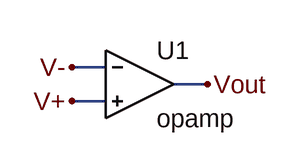
[diagram p0: schematic ideal op amp.asc]
ideal op amp.asc, the LTspice schematic file:
Version 4
SHEET 1 880 680
WIRE 96 48 64 48
WIRE 192 64 160 64
WIRE 96 80 64 80
FLAG 64 80 V+
FLAG 192 64 Vout
FLAG 64 48 V-
SYMBOL OpAmps\\opamp 128 0 R0
SYMATTR InstName U1

The netlist it stands for:
* ideal op amp.asc
XU1 V- V+ Vout opamp Aol=100K GBW=10Meg  ; pins invin noninvin out
.backanno
.end